# EAGLE design apic_shield_motor (EAGLE 8.3.2)
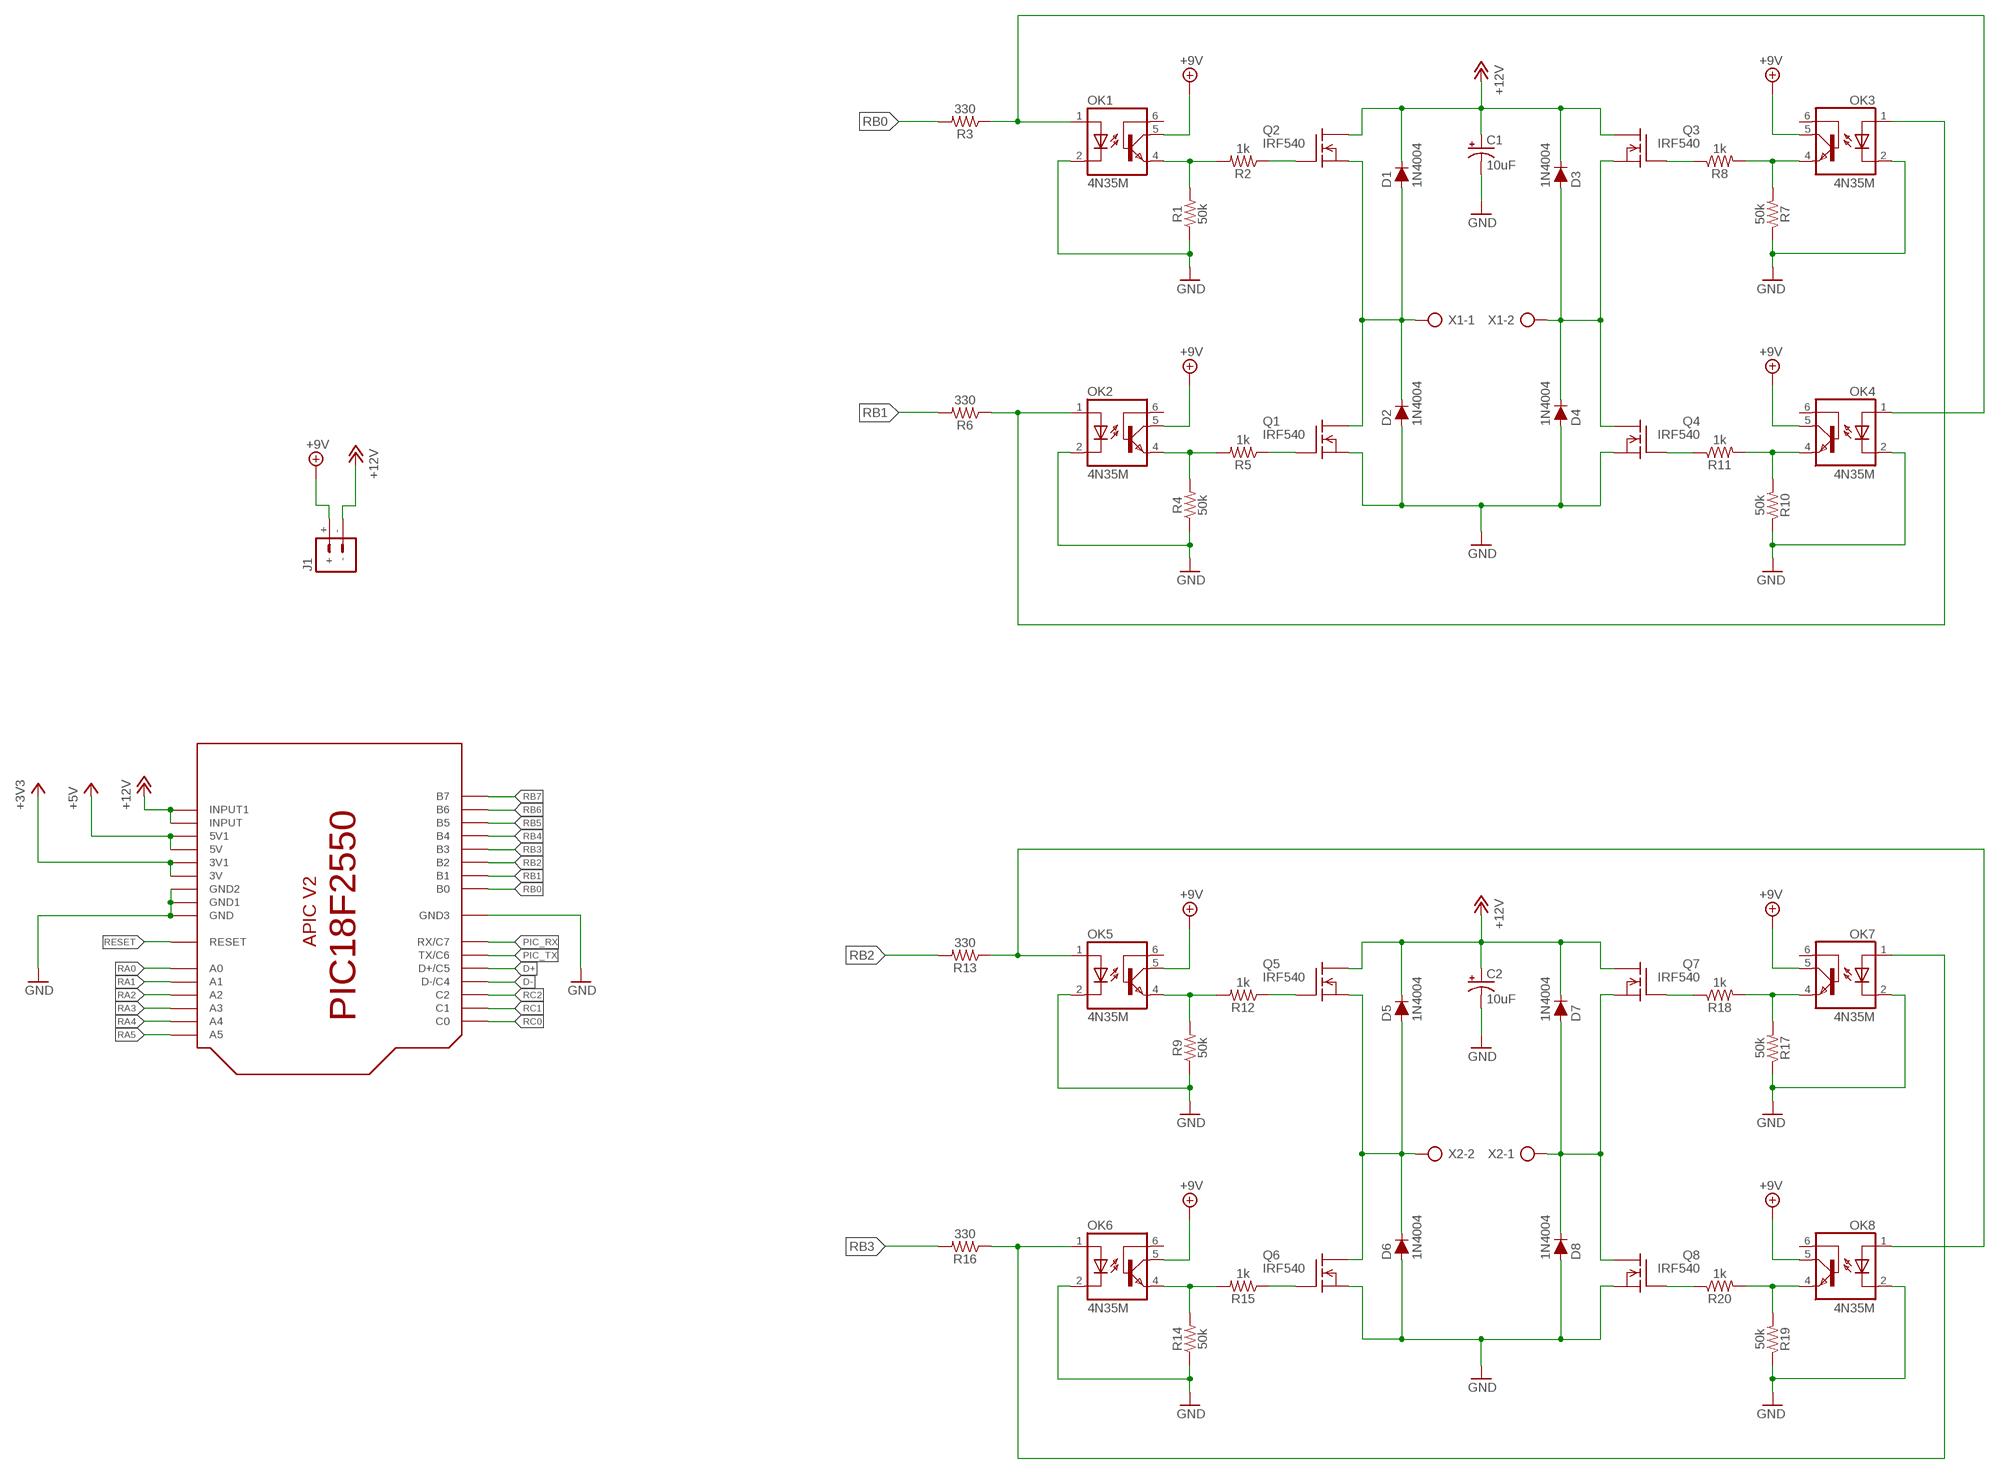
[diagram p0: schematic, sheet 1]

## Parts
C1  10uF  10UF-POLAR-RADIAL-2.5MM-25V-20%  [CPOL-RADIAL-2.5MM-5MM]
C2  10uF  10UF-POLAR-RADIAL-2.5MM-25V-20%  [CPOL-RADIAL-2.5MM-5MM]
D1  1N4004  DIODE-PTH  [DIODE-1N4001]
D2  1N4004  DIODE-PTH  [DIODE-1N4001]
D3  1N4004  DIODE-PTH  [DIODE-1N4001]
D4  1N4004  DIODE-PTH  [DIODE-1N4001]
D5  1N4004  DIODE-PTH  [DIODE-1N4001]
D6  1N4004  DIODE-PTH  [DIODE-1N4001]
D7  1N4004  DIODE-PTH  [DIODE-1N4001]
D8  1N4004  DIODE-PTH  [DIODE-1N4001]
J1  BATTERY_CONN_DEANS  [DEANS]
OK1  4N35M  [DIL06]
OK2  4N35M  [DIL06]
OK3  4N35M  [DIL06]
OK4  4N35M  [DIL06]
OK5  4N35M  [DIL06]
OK6  4N35M  [DIL06]
OK7  4N35M  [DIL06]
OK8  4N35M  [DIL06]
Q1  IRF540  [TO220V]
Q2  IRF540  [TO220V]
Q3  IRF540  [TO220V]
Q4  IRF540  [TO220V]
Q5  IRF540  [TO220V]
Q6  IRF540  [TO220V]
Q7  IRF540  [TO220V]
Q8  IRF540  [TO220V]
R1  50k  1KOHM-HORIZ-1/4W-1%  [AXIAL-0.3]
R2  1k  1KOHM-HORIZ-1/4W-1%  [AXIAL-0.3]
R3  330  1KOHM-HORIZ-1/4W-1%  [AXIAL-0.3]
R4  50k  1KOHM-HORIZ-1/4W-1%  [AXIAL-0.3]
R5  1k  1KOHM-HORIZ-1/4W-1%  [AXIAL-0.3]
R6  330  1KOHM-HORIZ-1/4W-1%  [AXIAL-0.3]
R7  50k  1KOHM-HORIZ-1/4W-1%  [AXIAL-0.3]
R8  1k  1KOHM-HORIZ-1/4W-1%  [AXIAL-0.3]
R9  50k  1KOHM-HORIZ-1/4W-1%  [AXIAL-0.3]
R10  50k  1KOHM-HORIZ-1/4W-1%  [AXIAL-0.3]
R11  1k  1KOHM-HORIZ-1/4W-1%  [AXIAL-0.3]
R12  1k  1KOHM-HORIZ-1/4W-1%  [AXIAL-0.3]
R13  330  1KOHM-HORIZ-1/4W-1%  [AXIAL-0.3]
R14  50k  1KOHM-HORIZ-1/4W-1%  [AXIAL-0.3]
R15  1k  1KOHM-HORIZ-1/4W-1%  [AXIAL-0.3]
R16  330  1KOHM-HORIZ-1/4W-1%  [AXIAL-0.3]
R17  50k  1KOHM-HORIZ-1/4W-1%  [AXIAL-0.3]
R18  1k  1KOHM-HORIZ-1/4W-1%  [AXIAL-0.3]
R19  50k  1KOHM-HORIZ-1/4W-1%  [AXIAL-0.3]
R20  1k  1KOHM-HORIZ-1/4W-1%  [AXIAL-0.3]
U$1  APIC-18F2550  [APIC-18F2550]
X1  AK500/2-H  [AK500/2-H]
X2  AK500/2-H  [AK500/2-H]

## Nets
+3V3: U$1.3V U$1.3V1
+5V: U$1.5V U$1.5V1
+9V: J1.+ OK1.5(COL) OK2.5(COL) OK3.5(COL) OK4.5(COL) OK5.5(COL) OK6.5(COL) OK7.5(COL) OK8.5(COL)
+12V: C1.1(+) C2.1(+) D1.C D3.C D5.C D7.C J1.- Q2.2(D) Q3.2(D) Q5.2(D) Q7.2(D) U$1.INPUT U$1.INPUT1
D+: U$1.C5(D+/C5)
D-: U$1.C4(D-/C4)
GND: C1.2(-) C2.2(-) D2.A D4.A D6.A D8.A OK1.2(C) OK2.2(C) OK3.2(C) OK4.2(C) OK5.2(C) OK6.2(C) OK7.2(C) OK8.2(C) Q1.3(S) Q4.3(S) Q6.3(S) Q8.3(S) R1.P$1 R4.P$1 R7.P$1 R9.P$1 R10.P$1 R14.P$1 R17.P$1 R19.P$1 U$1.GND U$1.GND1 U$1.GND2 U$1.GND3
N$1: OK1.4(EMI) R1.P$2 R2.P$2
N$2: Q2.1(G) R2.P$1
N$3: OK2.4(EMI) R4.P$2 R5.P$2
N$4: OK1.1(A) OK4.1(A) R3.P$1
N$5: Q1.1(G) R5.P$1
N$6: OK5.4(EMI) R9.P$2 R12.P$2
N$7: D1.A D2.C Q1.2(D) Q2.3(S) X1.1
N$8: OK3.4(EMI) R7.P$2 R8.P$2
N$9: OK2.1(A) OK3.1(A) R6.P$1
N$10: Q3.1(G) R8.P$1
N$11: Q5.1(G) R12.P$1
N$12: OK6.4(EMI) R14.P$2 R15.P$2
N$13: OK4.4(EMI) R10.P$2 R11.P$2
N$14: Q4.1(G) R11.P$1
N$15: D3.A D4.C Q3.3(S) Q4.2(D) X1.2
N$16: Q6.1(G) R15.P$1
N$17: OK6.1(A) OK7.1(A) R16.P$1
N$18: OK7.4(EMI) R17.P$2 R18.P$2
N$19: Q7.1(G) R18.P$1
N$20: OK8.4(EMI) R19.P$2 R20.P$2
N$21: Q8.1(G) R20.P$1
N$22: D5.A D6.C Q5.3(S) Q6.2(D) X2.2
N$23: D7.A D8.C Q7.3(S) Q8.2(D) X2.1
N$24: OK5.1(A) OK8.1(A) R13.P$1
PIC_RX: U$1.C7(RX/C7)
PIC_TX: U$1.C6(TX/C6)
RA0: U$1.A0
RA1: U$1.A1
RA2: U$1.A2
RA3: U$1.A3
RA4: U$1.A4
RA5: U$1.A5
RB0: R3.P$2 U$1.B0
RB1: R6.P$2 U$1.B1
RB2: R13.P$2 U$1.B2
RB3: R16.P$2 U$1.B3
RB4: U$1.B4
RB5: U$1.B5
RB6: U$1.B6
RB7: U$1.B7
RC0: U$1.C0
RC1: U$1.C1
RC2: U$1.C2
RESET: U$1.RESET
Unconnected: OK1.6(BAS) OK2.6(BAS) OK3.6(BAS) OK4.6(BAS) OK5.6(BAS) OK6.6(BAS) OK7.6(BAS) OK8.6(BAS)

## Library data of the parts
C1 C2 = SparkFun-Capacitors:10UF-POLAR: 10.0µF polarized capacitors A capacitor is a passive two-terminal electrical component used to store electrical energy temporarily in an electric field.; PROD_ID: CAP-08440
D1-D8 = SparkFun-DiscreteSemi:DIODE: Diode These are standard reverse protection diodes and small signal diodes. SparkFun Products: SparkFun SparkPunk Sound Kit <https://www.sparkfun.com/products/11177> SparkFun ESP8266 Thing <https://www.sparkfun.com/products/13231>; PROD_ID: DIO-09176; VALUE: 1A/50V/1.1V
J1 = SparkFun-Connectors:BATTERY_CONN: Battery Connectors Various footprints for battery connections SparkFun Products: Deans Connector -M/F Pair <https://www.sparkfun.com/products/11864>; SF_ID: PRT-11864
OK1-OK8 = optocoupler:4N*?M: General Purpose 6-Pin Phototransistor Optocouplers Source: http://www.fairchildsemi.com/ds/4N/4N35-M.pdf; MPN: 4N35-M; OC_FARNELL: 1021351; OC_NEWARK: 98K9114
Q1-Q8 = untitled:IRF540: N-Channel Enhancement MOSFET (HEXFET); 100V; 28A; 0,077Ohm
R1 R3 R4 R6 R7 R9 R10 R13 R14 R16 R17 R19 = SparkFun-Resistors:1KOHM: 1kΩ resistor A resistor is a passive two-terminal electrical component that implements electrical resistance as a circuit element. Resistors act to reduce current flow, and, at the same time, act to lower voltage levels within circuits. - Wikipedia; PROD_ID: RES-12182; VALUE: 1k
R2 R5 R8 R11 R12 R15 R18 R20 = SparkFun-Resistors:1KOHM: 1kΩ resistor A resistor is a passive two-terminal electrical component that implements electrical resistance as a circuit element. Resistors act to reduce current flow, and, at the same time, act to lower voltage levels within circuits. - Wikipedia; PROD_ID: RES-12182
U$1 = YAEL:APIC-18F2550
X1 X2 = con-ptr500:AK500/2-H: CONNECTOR Aug. 2004 / PTR Meßtechnik: Die Bezeichnung der Serie AK505 wurde geändert. Es handelt sich hierbei um AK500 in horizontaler Ausführung.; OC_FARNELL: unknown; OC_NEWARK: unknown

## Board
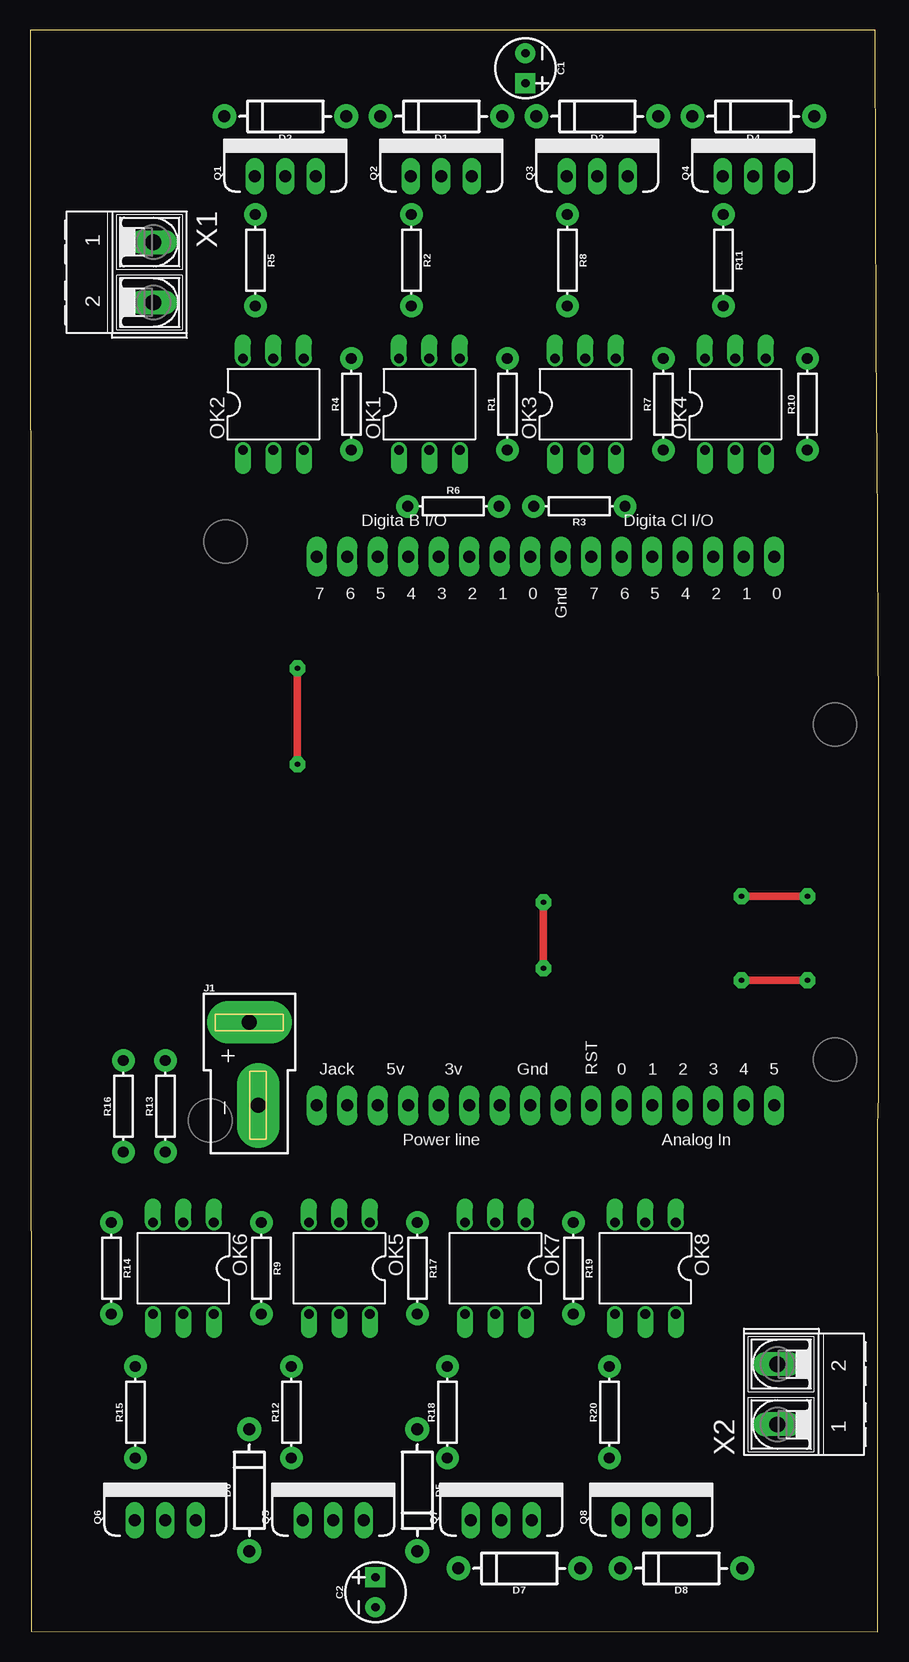
[diagram p1: board, top side]
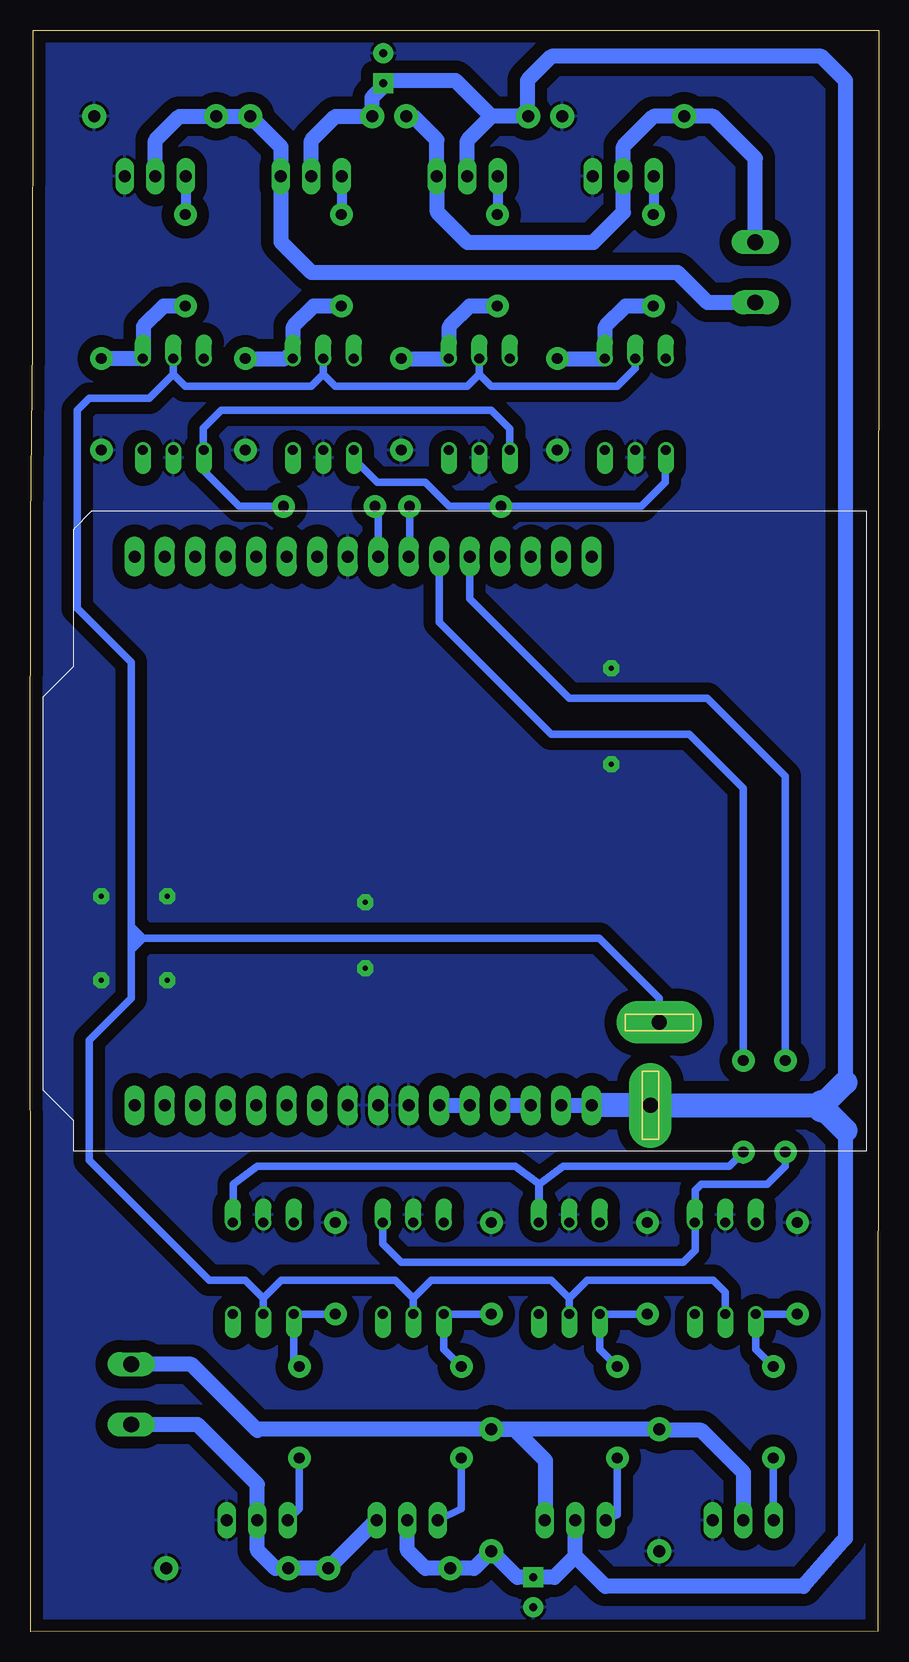
[diagram p2: board, bottom side, seen from below]

Size 70.72 x 133.49 mm. Coordinates in mm from the lower left corner, seen from the top.
Outline: 0.09,0.05 70.65,0 70.64,42.15 70.71,44.72 70.72,78.37 70.67,80.93 70.66,92.36 70.51,107.49 70.45,133.49 0,133.47 0.09,0.05
Copper layers (1*16): Top 0.035mm / dielectric 1.5mm / Bottom 0.035mm
Design rules "default": minimum track width 6mil, minimum drill 0.35mm, track to track 6mil, track to pad 6mil, pad to pad 6mil, via to via 6mil, smd to smd 6mil, copper to edge 40mil, drill to drill 6mil, minimum pad ring 10mil, minimum via ring 8mil, stop-mask expansion 4mil, vias tented up to drill 0mil, thermal gap 10mil

### Footprints (pad centres in the part's own frame; a part is rotated, then mirrored left to right if it is on the bottom)
CPOL-RADIAL-2.5MM-5MM = drill 0.7 pad 1.651 square: 1 1.25,0 | drill 0.7 pad 1.651: 2 -1.25,0
DIODE-1N4001 = drill 1 pad 1.981: A -5.08,0; C 5.08,0
DEANS = drill 1.27 pad 3.556 long: + 0,0; - 0.737,-6.921
DIL06 = drill 0.813 offset: 1 -2.54,-3.81; 2 0,-3.81; 3 2.54,-3.81; 4 2.54,3.81; 5 0,3.81; 6 -2.54,3.81
TO220V = drill 1.016 long: 1 -2.54,0; 2 0,0; 3 2.54,0
AXIAL-0.3 = drill 0.9 pad 1.88: P$1 -3.81,0; P$2 3.81,0
APIC-18F2550 = drill 1 pad 1.676 long: 3V 35.56,3.81; 3V1 33.02,3.81; 5V 30.48,3.81; 5V1 27.94,3.81; A0 48.26,3.81; A1 50.8,3.81; A2 53.34,3.81; A3 55.88,3.81; A4 58.42,3.81; A5 60.96,3.81; B0 40.64,49.53; B1 38.1,49.53; B2 35.56,49.53; B3 33.02,49.53; B4 30.48,49.53; B5 27.94,49.53; B6 25.4,49.53; B7 22.86,49.53; C0 60.96,49.53; C1 58.42,49.53; C2 55.88,49.53; C4 53.34,49.53; C5 50.8,49.53; C6 48.26,49.53; C7 45.72,49.53; GND 43.18,3.81; GND1 40.64,3.81; GND2 38.1,3.81; GND3 43.18,49.53; INPUT 25.4,3.81; INPUT1 22.86,3.81; RESET 45.72,3.81
AK500/2-H = drill 1.321 long: 1 -2.515,0; 2 2.515,0

### Placement (x,y rotation side)
C1  41.28,130.3 270 top
C2  28.78,3.3 90 top
D1  34.28,126.3 180 top
D2  21.28,126.3 180 top
D3  47.28,126.3 180 top
D4  60.28,126.3 180 top
D5  32.28,11.8 270 top
D6  18.28,11.8 90 top
D7  40.78,5.3 180 top
D8  54.28,5.3 180 top
J1  18.28,50.8 0 top
OK1  33.28,102.3 0 top
OK2  20.28,102.3 0 top
OK3  46.28,102.3 0 top
OK4  58.78,102.3 0 top
OK5  25.78,30.3 180 top
OK6  12.78,30.3 180 top
OK7  38.78,30.3 180 top
OK8  51.28,30.3 180 top
Q1  21.28,121.3 0 top
Q2  34.28,121.3 0 top
Q3  47.28,121.3 0 top
Q4  60.28,121.3 0 top
Q5  25.28,9.3 0 top
Q6  11.28,9.3 0 top
Q7  39.28,9.3 0 top
Q8  51.78,9.3 0 top
R1  39.78,102.3 90 top
R2  31.78,114.3 270 top
R3  45.78,93.8 180 top
R4  26.78,102.3 90 top
R5  18.78,114.3 270 top
R6  35.28,93.8 0 top
R7  52.78,102.3 90 top
R8  44.78,114.3 270 top
R9  19.28,30.3 270 top
R10  64.78,102.3 90 top
R11  57.78,114.3 270 top
R12  21.78,18.3 90 top
R13  11.28,43.8 90 top
R14  6.78,30.3 270 top
R15  8.78,18.3 90 top
R16  7.78,43.8 90 top
R17  32.28,30.3 270 top
R18  34.78,18.3 90 top
R19  45.28,30.3 270 top
R20  48.28,18.3 90 top
U$1  1.05,40.07 0 top
X1  10.28,113.3 270 top
X2  62.28,19.8 90 top

### Tracks (layer width: path | path; a pad name or v marks a point on that pad's centre or on a via)
+3V3
  Bottom 1.27: U$1.3V U$1.3V1
+5V
  Bottom 1.27: U$1.5V U$1.5V1
+9V
  Bottom 0.61: OK2.5 20.28,105.3 21.78,103.8 32.28,103.8 33.28,104.8 | 33.28,104.8 OK1.5 | 33.28,104.8 34.28,103.8 45.28,103.8 46.28,104.8 | 46.28,104.8 OK3.5 | 46.28,104.8 47.28,103.8 57.78,103.8 58.78,104.8 | 58.78,104.8 OK4.5 | 58.78,104.8 60.78,102.8 65.78,102.8 66.78,101.8 66.78,85.3 62.28,80.8 62.28,58.8 | OK6.5 12.78,28.3 13.78,29.3 24.28,29.3 25.78,27.8 | 25.78,27.8 OK5.5 | 25.78,27.8 27.28,29.3 37.28,29.3 38.78,27.8 | 38.78,27.8 OK7.5 | 38.78,27.8 40.28,29.3 49.78,29.3 51.28,27.8 | 51.28,27.8 OK8.5 | 62.28,58.8 62.28,57.8 | 62.28,56.8 62.28,57.8 | 62.28,56.8 62.28,52.8 65.78,49.3 65.78,39.3 55.78,29.3 52.78,29.3 51.28,27.8 | J1.+ 18.28,52.8 23.28,57.8 61.28,57.8 | 61.28,57.8 61.78,57.8 | 61.78,57.8 62.28,57.8 | 61.78,58.3 61.78,57.8 | 61.78,58.3 62.28,58.8 | 61.28,57.8 61.78,58.3 | 61.28,57.8 62.28,56.8
+12V
  Bottom 0.61: J1.- 19.28,43.88
  Bottom 1.27: U$1.INPUT U$1.INPUT1 | Q2.2 34.28,124.3 32.28,126.3 | Q3.2 47.28,124.3 45.28,126.3 D3.C 42.2,127.88 41.28,128.8 | 41.28,128.8 40.78,129.3 35.28,129.3 32.28,126.3 | 2.78,41.8 2.78,7.8 6.28,3.8 22.78,3.8 25.28,6.3 | 2.78,45.8 2.78,129.3 4.78,131.3 27.28,131.3 29.28,129.3 29.28,126.38 | D1.C 32.28,126.3 | C1.1 41.28,128.8 | 25.28,6.3 Q5.2 | 25.28,6.3 27.03,4.55 C2.1 30.11,4.55 D5.C 33.7,5.3 D7.C 37.78,5.3 39.28,6.8 Q7.2
  Bottom 2: U$1.INPUT1 19.28,43.88 4.7,43.88 2.78,45.8 | 4.7,43.72 2.78,41.8 | 29.28,126.38 D1.C
  Bottom 2.54: 4.7,43.88 4.7,43.72
GND  (via drill 0.45 pad 1.3)
  Top 0.61: v22.28,80.3 v22.28,72.3 | v42.78,55.3 v42.78,60.8 | v64.78,54.3 v59.28,54.3 | v64.78,61.3 v59.28,61.3
  pour Bottom (isolate 1.016): -5.84,-7 -2.76,134.83 73.88,134.67 70.8,-7.16
N$1
  Bottom 1.27: R2.P$2 34.09,110.49 35.78,108.8 35.78,106.15 | 35.78,106.15 OK1.4 | R1.P$2 OK1.4 | OK1.4 35.78,106.15
N$2
  Bottom 0.813: Q2.1 31.74,118.15 R2.P$1
N$3
  Bottom 1.27: R5.P$2 21.09,110.49 22.78,108.8 22.78,106.15 | 22.78,106.15 OK2.4 | R4.P$2 OK2.4 | OK2.4 22.78,106.15
N$4
  Bottom 0.61: OK1.1 30.74,100.26 32.28,101.8 54.78,101.8 56.28,100.3 56.28,98.53 | OK4.1 56.24,96.76 53.28,93.8 R3.P$1
  Bottom 1.27: 56.28,98.53 OK4.1
N$5
  Bottom 0.813: Q1.1 18.74,118.15 R5.P$1
N$6
  Bottom 0.61: R9.P$2 OK5.4 23.24,23.57 R12.P$2
N$7
  Bottom 1.27: D1.A 38.78,126.3 36.82,124.34 Q2.3 36.78,121.26 36.78,118.3 34.28,115.8 23.78,115.8 21.28,118.3 Q1.2 21.28,123.8 18.78,126.3 D2.C 13.78,126.3 10.28,122.8 X1.1
N$8
  Bottom 1.27: R8.P$2 47.09,110.49 48.78,108.8 48.78,106.15 | 48.78,106.15 OK3.4 | R7.P$2 49.47,106.11 49.28,106.3 48.93,106.3 48.78,106.15
N$9
  Bottom 0.61: OK2.1 17.78,98.45 17.78,95.8 19.78,93.8 R6.P$1 35.78,93.8 37.78,95.8 41.78,95.8 43.78,97.8 43.78,98.45 OK3.1
N$10
  Bottom 0.813: Q3.1 44.74,118.15 R8.P$1
N$11
  Bottom 0.61: 21.74,14.45 R12.P$1 21.78,9.76 Q5.1
N$12
  Bottom 0.61: R14.P$2 OK6.4 10.24,23.57 R15.P$2
N$13
  Bottom 1.27: R11.P$2 59.59,110.49 61.28,108.8 61.28,106.15 OK4.4 R10.P$2
N$14
  Bottom 0.813: Q4.1 57.74,118.15 R11.P$1
N$15
  Bottom 1.27: Q4.2 60.28,124.3 58.28,126.3 D4.C D3.A 49.82,123.76 Q3.3 49.82,115.84 47.28,113.3 16.78,113.3 14.28,110.8 10.29,110.8 X1.2
N$16
  Bottom 0.61: R15.P$1 8.78,9.34 Q6.1
N$17
  Bottom 0.61: 7.78,39.3 R16.P$1 7.78,38.8 9.28,37.3 14.78,37.3 15.28,36.8 15.28,34.15 | 15.28,34.15 OK6.1 | 15.28,34.15 15.28,31.8 16.28,30.8 39.78,30.8 41.32,32.34 OK7.1
N$18
  Bottom 0.61: R17.P$2 OK7.4 36.24,23.57 R18.P$2
N$19
  Bottom 0.61: 34.74,14.45 R18.P$1 34.78,10.26 Q7.1
N$20
  Bottom 0.61: R19.P$2 OK8.4 48.74,22.57 R20.P$2
N$21
  Bottom 0.61: 48.24,14.45 R20.P$1 48.28,10.26 Q8.1
N$22
  Bottom 1.27: Q6.2 11.28,13.3 14.78,16.8 18.2,16.8 D6.C D5.A | X2.2 62.27,22.3 57.28,22.3 51.78,16.8 51.7,16.88 D5.A | D5.A 30.36,16.88 27.78,14.3 27.78,9.34 Q5.3
N$23
  Bottom 1.27: X2.1 56.77,17.28 51.78,12.3 Q8.2 51.78,6.8 50.28,5.3 D8.C D7.A 41.86,9.3 Q7.3
N$24
  Bottom 0.61: 11.28,39.3 R13.P$1 12.47,38.8 26.28,38.8 28.28,37.3 28.28,34.15 OK5.1 28.32,37.34 30.28,38.8 51.78,38.8 53.78,37.3 53.78,34.15 OK8.1
RB0
  Bottom 0.61: R3.P$2 41.69,93.52 U$1.B0
RB1
  Bottom 0.61: R6.P$2 39.09,89.66
  Bottom 0.813: 39.09,89.66 U$1.B1
RB2
  Bottom 0.61: U$1.B2 36.61,84.13 27.28,74.8 15.78,74.8 11.28,70.3 R13.P$2
RB3
  Bottom 0.61: U$1.B3 34.07,86.09 25.78,77.8 14.28,77.8 7.78,71.3 7.78,47.8 8.28,47.3 8.09,47.3 R16.P$2